# Altium schematic sheet Electrode-Front-End-Digital.SchDoc
size A4; DocumentNumber: 1; SheetNumber: 1; SheetTotal: 2
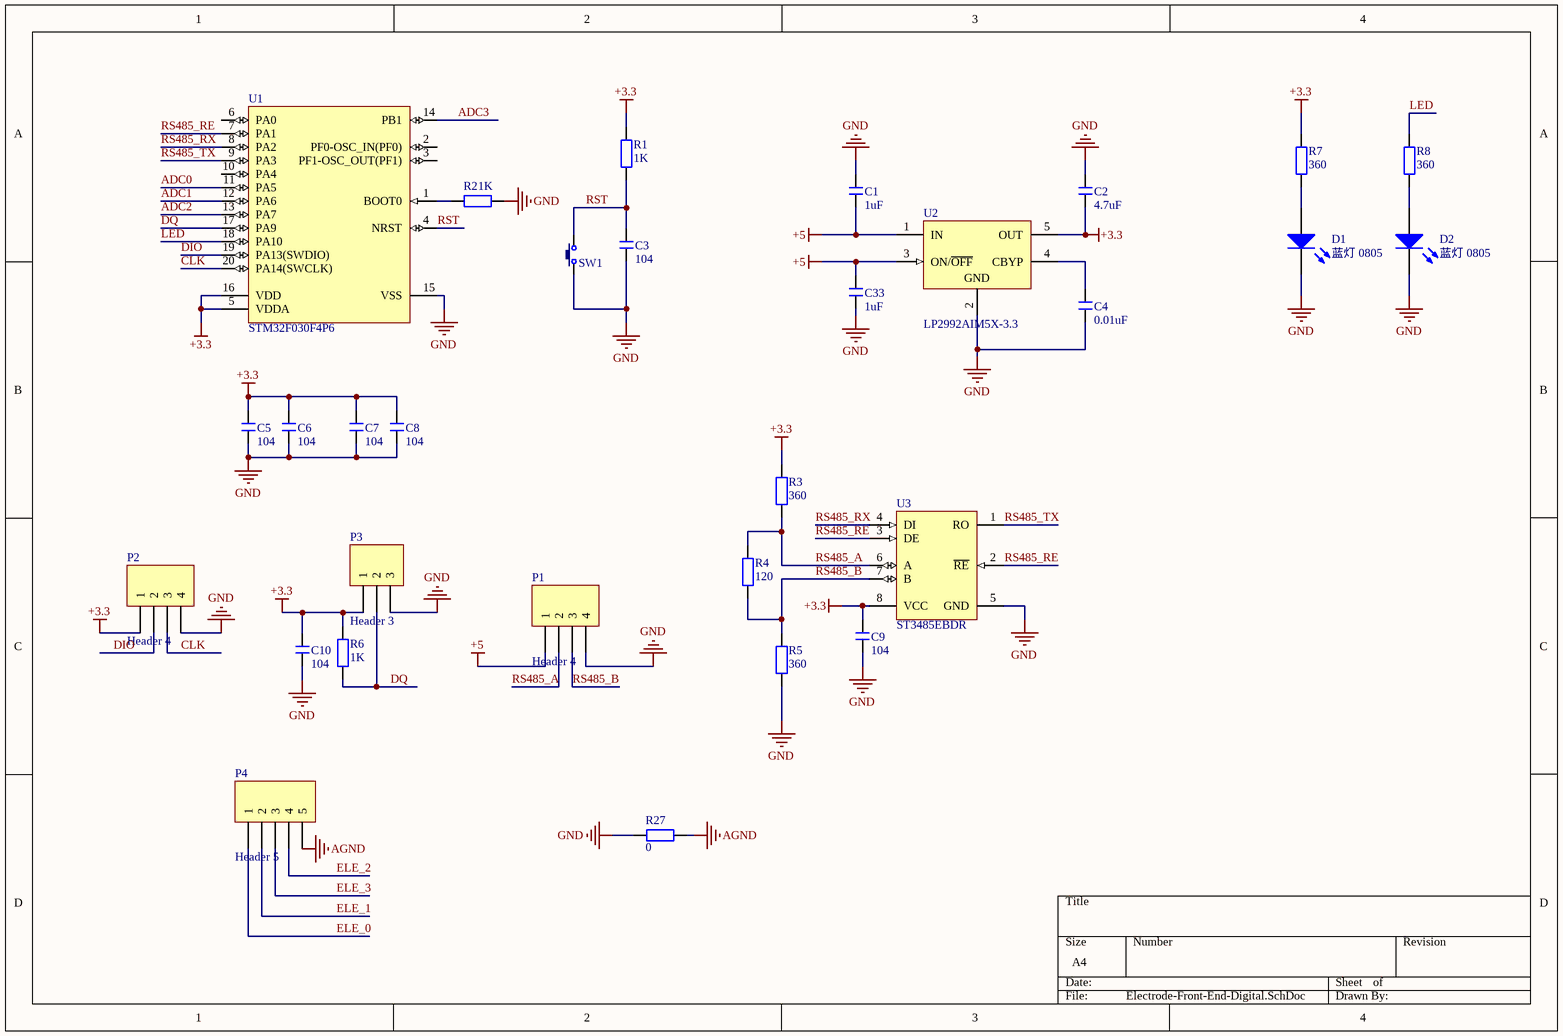
[diagram p0: Electrode-Front-End-Digital.SchDoc]

## Parts
C1  1uF  [C 0603_L]
C2  4.7uF  [C 0603_L]
C3  104  [C 0603_L]
C4  0.01uF  [C 0603_L]
C5  104  [C 0603_L]
C6  104  [C 0603_L]
C7  104  [C 0603_L]
C8  104  [C 0603_L]
C9  104  [C 0603_L]
C10  104  [C 0603_L]
C33  1uF  [C 0603_L]
D1  蓝灯 0805  [0805_LED_S1]
D2  蓝灯 0805  [0805_LED_S1]
P1  Header 4  [HDR1X4]
P2  Header 4  [HDR1X4]
P3  Header 3  [HDR1X3]
P4  Header 5  [HDR1X5]
R1  1K  [R 0603_L]
R2  1K  [R 0603_L]
R3  360  [R 0603_L]
R4  120  [R 0603_L]
R5  360  [R 0603_L]
R6  1K  [R 0603_L]
R7  360  [R 0603_L]
R8  360  [R 0603_L]
R27  0  [R 0603_L]
SW1  3x6x5  [TSW SMD-3*6*2.5]  (value not drawn)
U1  STM32F030F4P6  [STM-TSSOP20_L]
U2  LP2992AIM5X-3.3  [MF05A_N]
U3  ST3485EBDR  [STM-SO-8_C_L]

## Nets
+3.3: C2.1 C5.2 C6.2 C7.2 C8.2 C9.2 C10.2 P2.1 P3.1 R1.2 R3.2 R6.2 R7.2 U1.5(VDDA) U1.16(VDD) U2.5(OUT) U3.8(VCC)
+5: C1.1 C33.2 P1.1 U2.1(IN) U2.3(ON/~{OFF})
AGND: P4.5 R27.2
GND: C1.2 C2.2 C3.1 C4.2 C5.1 C6.1 C7.1 C8.1 C9.1 C10.1 C33.1 D1.K D2.K P1.4 P2.4 P3.3 R2.2 R5.1 R27.1 SW1.1 U1.15(VSS) U2.2(GND) U3.5(GND)
ADC0: U1.11(PA5)
ADC1: U1.12(PA6)
ADC2: U1.13(PA7)
ADC3: U1.14(PB1)
CLK: P2.3 U1.20(PA14(SWCLK))
DIO: P2.2 U1.19(PA13(SWDIO))
DQ: P3.2 R6.1 U1.17(PA9)
ELE_0: P4.1
ELE_1: P4.2
ELE_2: P4.4
ELE_3: P4.3
LED: R8.2 U1.18(PA10)
RS485_A: P1.2 R3.1 R4.2 U3.6(A)
RS485_B: P1.3 R4.1 R5.2 U3.7(B)
RS485_RE: U1.7(PA1) U3.2(~{RE}) U3.3(DE)
RS485_RX: U1.8(PA2) U3.4(DI)
RS485_TX: U1.9(PA3) U3.1(RO)
RST: C3.2 R1.1 SW1.2 U1.4(NRST)
NetC4_1: C4.1 U2.4(CBYP)
NetD1_A: D1.A R7.1
NetD2_A: D2.A R8.1
NetR2_1: R2.1 U1.1(BOOT0)

Not connected (* = marked no-connect by the designer): U1 2(PF0-OSC_IN(PF0)) 3(PF1-OSC_OUT(PF1)) 6(PA0) 10(PA4)

## Library data of the parts
C1-C10 C33 = C: 无极性贴片电容; 材质: X7R; BOM名称: 无极性贴片电容
D1 D2 = 0805 蓝灯: 发光二极管; ComponentLink1Description: 供应商链接; ComponentLink1URL: http://www.szlcsc.com/product/details_2666.html; Package: 0805; Supplier: LC; SuppliersPartNumber: C2293
P1 P2 = Header 4: Header, 4-Pin; LatestRevisionDate: 17-Jul-2002; LatestRevisionNote: Re-released for DXP Platform.; Publisher: Altium Limited
P3 = Header 3: Header, 3-Pin; LatestRevisionDate: 17-Jul-2002; LatestRevisionNote: Re-released for DXP Platform.; Publisher: Altium Limited
P4 = Header 5: Header, 5-Pin; LatestRevisionDate: 17-Jul-2002; LatestRevisionNote: Re-released for DXP Platform.; Publisher: Altium Limited
R1-R8 R27 = R: 贴片电阻; BOM名称: 贴片电阻
SW1 = TSW 3x6: 3x6轻触开关; BOM名称: 3x6轻触开关
U1 = CMP-0304-00039-2: ARM Cortex-M0 32-bit MCU, 16 KB Flash, 4 KB Internal RAM, 15 I/Os, 20-pin TSSOP, -40 to 85 degC, Tube; I/Os (High Current): 15; FLASH Size (Prog) (kB): 16; Internal RAM Size (kB): 4; Supply Voltage(Vcc) min (V): 2.4; Operating Frequency(F) (Processor speed) (MHz): 48; ComponentLink2URL: http://www.st.com/st-web-ui/static/active/en/resource/technical/document/datasheet/DM00088500.pdf; Core: ARM Cortex-M0; ComponentLink2Description: Datasheet; PackageDescription: 20-Pin Thin Shrink Small Outline Package, 6.5 x 4.4 mm Body, 0.65 mm Pitch; Mounting Technology: Surface Mount; ComponentLink1URL: http://www.st.com/web/en/home.html; PackageVersion: Rev. 1, 11/2012; ComponentLink3Description: Package Specification; PartNumber: STM32F030F4P6; ComponentLink3URL: http://www.st.com/st-web-ui/static/active/en/resource/technical/document/datasheet/DM00065136.pdf; DatasheetVersion: Rev. 1; PackageReference: TSSOP20; ComponentLink1Description: Manufacturer URL; Packing: Tube
U2 = CMP-0062-02134-2: Micropower 250 mA Low-Noise Ultra Low-Dropout Regulator, 5-pin SOT-23; Manufacturer: National Semiconductor; PackageTopMarking: LFEA*XTT; PowerWise: N; CompType: LDO IC; PinCount: 5; PackageReference: MF05A; ComponentLink1URL: http://www.national.com/ds/LP/LP2992.pdf; RevisionNote: Component URLs added; ComponentLink1Description: LP2992 Datasheet; ComponentLink3Description: MF05A Package Page; ComponentLink2URL: http://www.national.com/pf/LP/LP2992.html; PackageDescription: Molded SOT-23, .115 x .063 x .040 in Body, 5 Lead, .0375 in Pitch; RoHS: N; ComponentLink2Description: LP2992 Web Page; DatasheetVersion: May-2005; ComponentLink3URL: http://www.national.com/packaging/folders/mf05a.html; PackageVersion: revD, Aug-2008
U3 = CMP-2000-07158-1: 15 KV ESD Protected, Up to 12 Mbps RS-485/RS-422 Transceiver, 3.3 V, -40 to 85 degC, 8-Pin SOIC (SO-8), RoHS, Tape and Reel; Manufacturer: STMicroelectronics; Data Transmission Topology: Multidrop/Multipoint; Number of Receivers: 1; Single Supply Voltage (Typ): 3.3V; Power Supply Requirement: Single; Dual Supply Voltage (Min): NotRequiredV; Interface Circuit Standard 1: RS-422/RS-485; Transmitter Signal Type: Differential; Single Supply Voltage (Min): 3V; Supply Current: 2.2mA; DELETED: Compliant; Single Supply Voltage (Max): 3.6V; Rad Hardened: No; Data Rate: 15kbps; Package Description: 8-Pin Small Outline Integrated Circuit, Body 4.9 x 3.9 mm, Pitch 1.27 mm; Operating Temp Range: -40Cto85C; Package Reference: SO-8; Pin Count: 8; Dual Supply Voltage (Max): NotRequiredV; Number of Transmitters: 1; Receiver Signal Type: Differential; Dual Supply Voltage (Typ): NotRequiredV; Mounting Technology: SurfaceMount; Package Type: SOICN; Number of Transceivers: 1; Operating Temperature Classification: Industrial; Datasheet URL: http://www.produktinfo.conrad.com/datenblaetter/1100000-1199999/001185042-da-01-en-IC_TXRX_3_3V_RS485_ST3485EBDR_SOIC_8_STM.pdf; Datasheet Version: Rev. 6 , 12/2013; Mounting: SurfaceMount; Packaging: TapeandReel; Manufacturer URL: http://www.st.com/